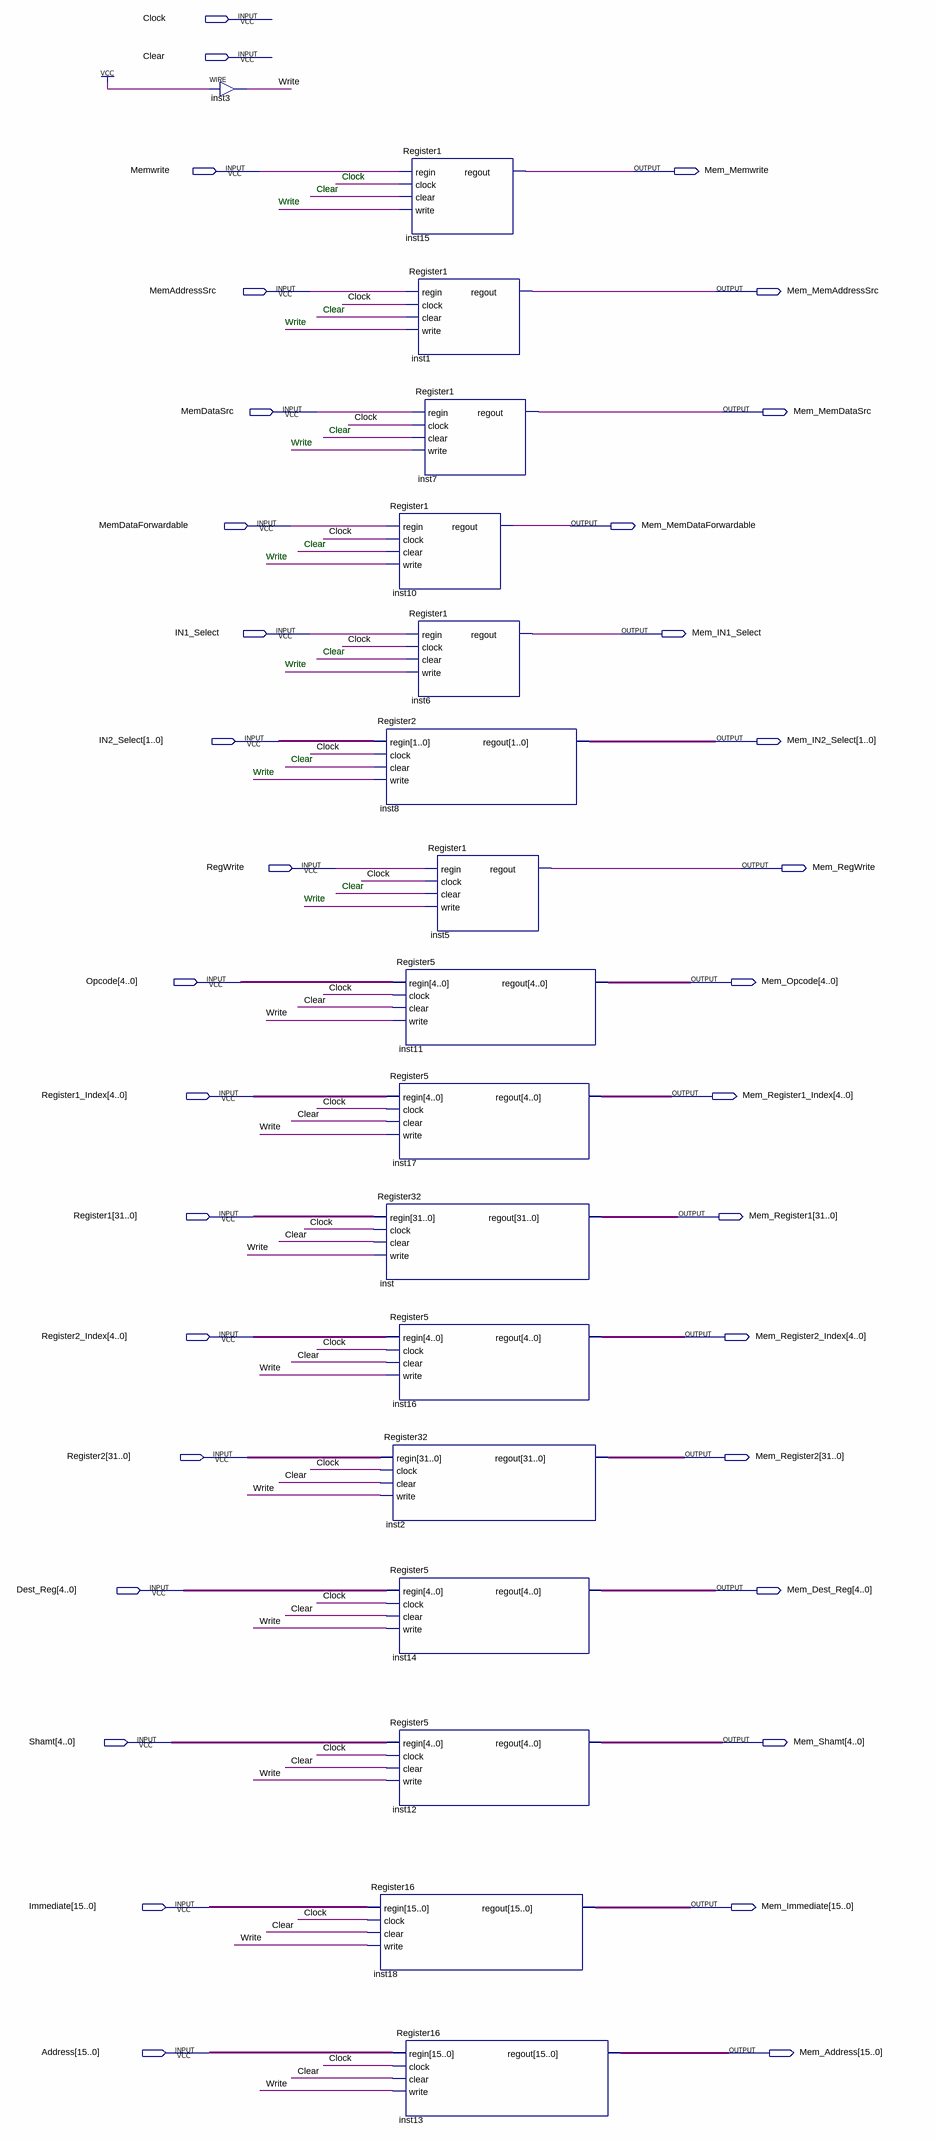
[diagram p0: schematic sheet]
// Quartus schematic IDtoMemRegs.bdf as structural Verilog: 17 symbols, 34 pins
module IDtoMemRegs (
  input  Clock,
  input  Clear,
  input  Memwrite,
  input  MemAddressSrc,
  input  MemDataSrc,
  input  MemDataForwardable,
  input  IN1_Select,
  input  [1:0] IN2_Select,
  input  RegWrite,
  input  [4:0] Opcode,
  input  [4:0] Register1_Index,
  input  [31:0] Register1,
  input  [4:0] Register2_Index,
  input  [31:0] Register2,
  input  [4:0] Dest_Reg,
  input  [4:0] Shamt,
  input  [15:0] Immediate,
  input  [15:0] Address,
  output Mem_Memwrite,
  output Mem_MemAddressSrc,
  output Mem_MemDataSrc,
  output Mem_MemDataForwardable,
  output Mem_IN1_Select,
  output [1:0] Mem_IN2_Select,
  output Mem_RegWrite,
  output [4:0] Mem_Opcode,
  output [4:0] Mem_Register1_Index,
  output [31:0] Mem_Register1,
  output [4:0] Mem_Register2_Index,
  output [31:0] Mem_Register2,
  output [4:0] Mem_Dest_Reg,
  output [4:0] Mem_Shamt,
  output [15:0] Mem_Immediate,
  output [15:0] Mem_Address
);

  wire Write;

  assign Write = 1'b1;  // WIRE inst3
  Register1 inst15 (.regin(Memwrite), .clock(Clock), .clear(Clear), .write(Write), .regout(Mem_Memwrite));
  Register1 inst1 (.regin(MemAddressSrc), .clock(Clock), .clear(Clear), .write(Write), .regout(Mem_MemAddressSrc));
  Register1 inst7 (.regin(MemDataSrc), .clock(Clock), .clear(Clear), .write(Write), .regout(Mem_MemDataSrc));
  Register1 inst10 (
    .regin(MemDataForwardable), .clock(Clock), .clear(Clear), .write(Write), .regout(Mem_MemDataForwardable));
  Register1 inst6 (.regin(IN1_Select), .clock(Clock), .clear(Clear), .write(Write), .regout(Mem_IN1_Select));
  Register2 inst8 (.regin(IN2_Select), .clock(Clock), .clear(Clear), .write(Write), .regout(Mem_IN2_Select));
  Register5 inst11 (.regin(Opcode), .clock(Clock), .clear(Clear), .write(Write), .regout(Mem_Opcode));
  Register5 inst17 (.regin(Register1_Index), .clock(Clock), .clear(Clear), .write(Write), .regout(Mem_Register1_Index));
  Register32 inst (.regin(Register1), .clock(Clock), .clear(Clear), .write(Write), .regout(Mem_Register1));
  Register5 inst16 (.regin(Register2_Index), .clock(Clock), .clear(Clear), .write(Write), .regout(Mem_Register2_Index));
  Register32 inst2 (.regin(Register2), .clock(Clock), .clear(Clear), .write(Write), .regout(Mem_Register2));
  Register5 inst14 (.regin(Dest_Reg), .clock(Clock), .clear(Clear), .write(Write), .regout(Mem_Dest_Reg));
  Register5 inst12 (.regin(Shamt), .clock(Clock), .clear(Clear), .write(Write), .regout(Mem_Shamt));
  Register16 inst18 (.regin(Immediate), .clock(Clock), .clear(Clear), .write(Write), .regout(Mem_Immediate));
  Register16 inst13 (.regin(Address), .clock(Clock), .clear(Clear), .write(Write), .regout(Mem_Address));
  Register1 inst5 (.regin(RegWrite), .clock(Clock), .clear(Clear), .write(Write), .regout(Mem_RegWrite));

  // Notes on the sheet:
  //   Clock
  //   Clear
  //   Write
  //   Clear
  //   Write
  //   Clear
  //   Write
  //   Clear
  //   Write
  //   Clear
  //   Write
  //   Clear
  //   Write
  //   Clear
  //   Write
endmodule
